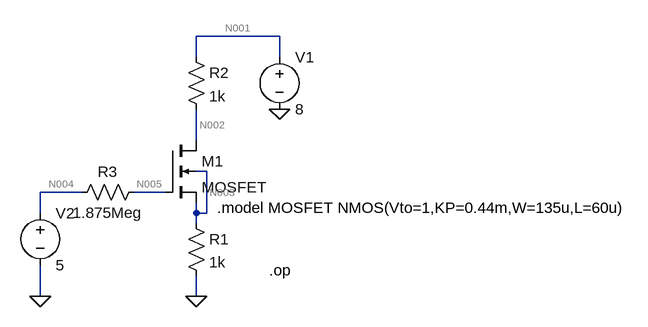
[diagram p0: schematic question_1.asc]
question_1.asc, the LTspice schematic file:
Version 4.1
SHEET 1 928 680
WIRE 352 -32 224 -32
WIRE 224 0 224 -32
WIRE 352 0 352 -32
WIRE 224 128 224 80
WIRE 240 176 224 176
WIRE 48 208 -16 208
WIRE 176 208 128 208
WIRE -16 240 -16 208
WIRE 224 240 224 224
WIRE 240 240 240 176
WIRE 240 240 224 240
WIRE 224 256 224 240
WIRE -16 368 -16 320
WIRE 224 368 224 336
FLAG 224 368 0
FLAG 352 80 0
FLAG -16 368 0
SYMBOL nmos4 176 128 R0
SYMATTR InstName M1
SYMATTR Value2 l=60u w=135u
SYMATTR Value MOSFET
SYMBOL res 208 240 R0
SYMATTR InstName R1
SYMATTR Value 1k
SYMBOL res 208 -16 R0
SYMATTR InstName R2
SYMATTR Value 1k
SYMBOL voltage 352 -16 R0
WINDOW 123 0 0 Left 0
WINDOW 39 0 0 Left 0
SYMATTR InstName V1
SYMATTR Value 8
SYMBOL res 144 192 R90
WINDOW 0 0 56 VBottom 2
WINDOW 3 32 56 VTop 2
SYMATTR InstName R3
SYMATTR Value 1.875Meg
SYMBOL voltage -16 224 R0
WINDOW 123 0 0 Left 0
WINDOW 39 0 0 Left 0
SYMATTR InstName V2
SYMATTR Value 5
TEXT 256 232 Left 2 !.model MOSFET NMOS(Vto=1,KP=0.44m,W=135u,L=60u)
TEXT 336 328 Left 2 !.op

The netlist it stands for:
* question_1.asc
M1 N002 N005 N003 N003 MOSFET l=60u w=135u
R1 N003 0 1k
R2 N001 N002 1k
V1 N001 0 8
R3 N005 N004 1.875Meg
V2 N004 0 5
.model NMOS NMOS
.model PMOS PMOS
.lib standard.mos
.model MOSFET NMOS(Vto=1,KP=0.44m,W=135u,L=60u)
.op
.backanno
.end

* Results of the author's LTspice run, read from the files saved beside the schematic
* Operating Point:
*   V(n005) = 5 V
*   V(n001) = 8 V
*   V(n004) = 5 V
*   V(n002) = 6.007 V
*   V(n003) = 1.993 V
*   Id(M1) = 1.993 mA
*   Ig(M1) = 0 A
*   Is(M1) = -1.993 mA
*   Ib(M1) = -4.023 pA
*   I(R2) = 1.993 mA
*   I(R3) = 0 A
*   I(V2) = 0 A
*   I(V1) = -1.993 mA
*   I(R1) = 1.993 mA
* From the log:
*   Semiconductor Device Operating Points:
*                           --- MOSFET Transistors ---
*   Name:           M1
*   Model:        mosfet
*   Id:          1.99e-03
*   Vgs:         3.01e+00
*   Vds:         4.01e+00
*   Vbs:         0.00e+00
*   Vth:         1.00e+00
*   Vdsat:       2.01e+00
*   Gm:          1.99e-03
*   Gds:         0.00e+00
*   Gmb:         0.00e+00
*   Cbd:         0.00e+00
*   Cbs:         0.00e+00
*   Cgsov:       0.00e+00
*   Cgdov:       0.00e+00
*   Cgbov:       0.00e+00
*   Cgs:         0.00e+00
*   Cgd:         0.00e+00
*   Cgb:         0.00e+00